# Altium schematic sheet High_Side_FETs.SchDoc
size A4; Organization: TESLA Motors, INC; Address1: 3500 Deer Creek Road; Address2: Palo Alto, CA; Address4: U.S.A.; SheetNumber: 5; SheetTotal: 8
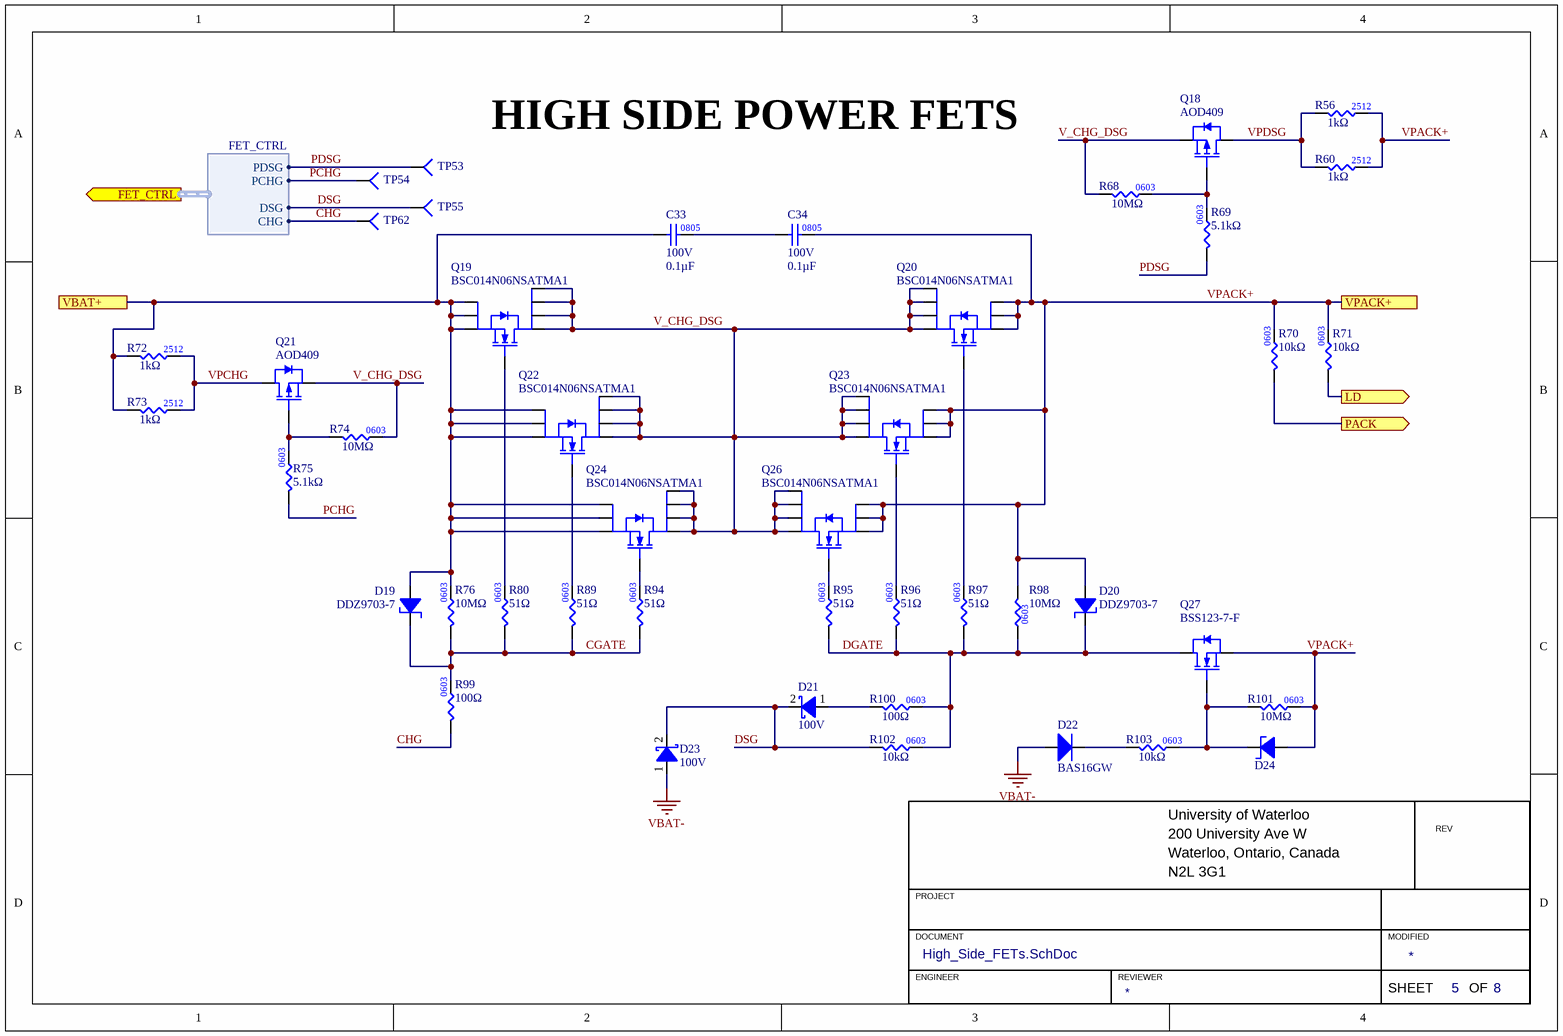
[diagram p0: High_Side_FETs.SchDoc]

## Parts
C33  value 0.1µF  Voltage Rating: 100V  [CAP0805]  (hidden comment: CAP_0.1uF_100V_0805)
C34  value 0.1µF  Voltage Rating: 100V  [CAP0805]  (hidden comment: CAP_0.1uF_100V_0805)
D19  Manufacturer Part Number 1: DDZ9703-7  [SOD-123_FLAT]  (hidden comment: DIO_ZENER_16V)
D20  Manufacturer Part Number 1: DDZ9703-7  [SOD-123_FLAT]  (hidden comment: DIO_ZENER_16V)
D21  Vr (Max): 100V  [SOD-123_FLAT]  (hidden comment: DIO_SCHOTTKY_100V_1A)
D22  Manufacturer Part Number 1: BAS16GW  [DIODSOD-123]  (hidden comment: DIO_100V_215mA)
D23  Vr (Max): 100V  [SOD-123_FLAT]  (hidden comment: DIO_SCHOTTKY_100V_1A)
D24  DIO_ZENER_16V  [SOD-123_FLAT]  (value not drawn)
Q18  Manufacturer Part Number 1: AOD409  [TO-252 AOSMD]  (hidden comment: PMOS_60V_26A)
Q19  Manufacturer Part Number 1: BSC014N06NSATMA1  [INFINEON_8-POWERTDFN]  (hidden comment: NMOS_60V_30A)
Q20  Manufacturer Part Number 1: BSC014N06NSATMA1  [INFINEON_8-POWERTDFN]  (hidden comment: NMOS_60V_30A)
Q21  Manufacturer Part Number 1: AOD409  [TO-252 AOSMD]  (hidden comment: PMOS_60V_26A)
Q22  Manufacturer Part Number 1: BSC014N06NSATMA1  [INFINEON_8-POWERTDFN]  (hidden comment: NMOS_60V_30A)
Q23  Manufacturer Part Number 1: BSC014N06NSATMA1  [INFINEON_8-POWERTDFN]  (hidden comment: NMOS_60V_30A)
Q24  Manufacturer Part Number 1: BSC014N06NSATMA1  [INFINEON_8-POWERTDFN]  (hidden comment: NMOS_60V_30A)
Q26  Manufacturer Part Number 1: BSC014N06NSATMA1  [INFINEON_8-POWERTDFN]  (hidden comment: NMOS_60V_30A)
Q27  Manufacturer Part Number 1: BSS123-7-F  [SOT23-3]  (hidden comment: NMOS_100V_170mA)
R56  value 1kΩ  [RES2512]  (hidden comment: RES_1kΩ_2512_1%)
R60  value 1kΩ  [RES2512]  (hidden comment: RES_1kΩ_2512_1%)
R68  value 10MΩ  [RES0603]  (hidden comment: RES_10MΩ_0603_1%)
R69  value 5.1kΩ  [RES0603]  (hidden comment: RES_5.1kΩ_0603_1%)
R70  value 10kΩ  [RES0603]  (hidden comment: RES_10kΩ_0603_1%)
R71  value 10kΩ  [RES0603]  (hidden comment: RES_10kΩ_0603_1%)
R72  value 1kΩ  [RES2512]  (hidden comment: RES_1kΩ_2512_1%)
R73  value 1kΩ  [RES2512]  (hidden comment: RES_1kΩ_2512_1%)
R74  value 10MΩ  [RES0603]  (hidden comment: RES_10MΩ_0603_1%)
R75  value 5.1kΩ  [RES0603]  (hidden comment: RES_5.1kΩ_0603_1%)
R76  value 10MΩ  [RES0603]  (hidden comment: RES_10MΩ_0603_1%)
R80  value 51Ω  [RES0603]  (hidden comment: RES_51Ω_0603_1%)
R89  value 51Ω  [RES0603]  (hidden comment: RES_51Ω_0603_1%)
R94  value 51Ω  [RES0603]  (hidden comment: RES_51Ω_0603_1%)
R95  value 51Ω  [RES0603]  (hidden comment: RES_51Ω_0603_1%)
R96  value 51Ω  [RES0603]  (hidden comment: RES_51Ω_0603_1%)
R97  value 51Ω  [RES0603]  (hidden comment: RES_51Ω_0603_1%)
R98  value 10MΩ  [RES0603]  (hidden comment: RES_10MΩ_0603_1%)
R99  value 100Ω  [RES0603]  (hidden comment: RES_100Ω_0603_1%)
R100  value 100Ω  [RES0603]  (hidden comment: RES_100Ω_0603_1%)
R101  value 10MΩ  [RES0603]  (hidden comment: RES_10MΩ_0603_1%)
R102  value 10kΩ  [RES0603]  (hidden comment: RES_10kΩ_0603_1%)
R103  value 10kΩ  [RES0603]  (hidden comment: RES_10kΩ_0603_1%)
TP53  TESTPOINT_1MM_CIRCLE  [TESTPOINT_CIRCLE_1MM]  (value not drawn)  (no BOM)
TP54  TESTPOINT_1MM_CIRCLE  [TESTPOINT_CIRCLE_1MM]  (value not drawn)  (no BOM)
TP55  TESTPOINT_1MM_CIRCLE  [TESTPOINT_CIRCLE_1MM]  (value not drawn)  (no BOM)
TP62  TESTPOINT_1MM_CIRCLE  [TESTPOINT_CIRCLE_1MM]  (value not drawn)  (no BOM)

## Ports
FET_CTRL (out, harness FET_CTRL), LD (out), PACK (out), VBAT+, VPACK+

## Harnesses
FET_CTRL: PDSG, PCHG, DSG, CHG

## Nets
VBAT-: D22.1(A) D23.1(Anode)
CGATE: D19.2(Cathode) R76.1 R80.1 R89.1 R94.1 R99.2
CHG: R99.1 TP62.1(=value) ; port FET_CTRL.CHG
DGATE: D20.2(Cathode) Q27.3(DRAIN) R95.1 R96.1 R97.1 R98.1 R100.2 R102.2
DSG: D21.2(Cathode) D23.2(Cathode) R102.1 TP55.1(=value) ; port FET_CTRL.DSG
LD: R71.1 ; port LD
PACK: R70.1 ; port PACK
PCHG: R75.1 TP54.1(=value) ; port FET_CTRL.PCHG
PDSG: R69.1 TP53.1(=value) ; port FET_CTRL.PDSG
V_CHG_DSG: Q18.3(Source) Q19.5(Drain) Q19.6(Drain) Q19.7(Drain) Q19.8(Drain) Q20.5(Drain) Q20.6(Drain) Q20.7(Drain) Q20.8(Drain) Q21.3(Source) Q22.5(Drain) Q22.6(Drain) Q22.7(Drain) Q22.8(Drain) Q23.5(Drain) Q23.6(Drain) Q23.7(Drain) Q23.8(Drain) Q24.5(Drain) Q24.6(Drain) Q24.7(Drain) Q24.8(Drain) Q26.5(Drain) Q26.6(Drain) Q26.7(Drain) Q26.8(Drain) R68.1 R74.2
VBAT+: C33.1 D19.1(Anode) Q19.1(Source) Q19.2(Source) Q19.3(Source) Q22.1(Source) Q22.2(Source) Q22.3(Source) Q24.1(Source) Q24.2(Source) Q24.3(Source) R72.1 R73.1 R76.2 ; port VBAT+
VPACK+: C34.2 D20.1(Anode) D24.1(Anode) Q20.1(Source) Q20.2(Source) Q20.3(Source) Q23.1(Source) Q23.2(Source) Q23.3(Source) Q26.1(Source) Q26.2(Source) Q26.3(Source) Q27.2(SOURCE) R56.2 R60.2 R70.2 R71.2 R98.2 R101.2 ; port VPACK+
VPCHG: Q21.2(Drain) R72.2 R73.2
VPDSG: Q18.2(Drain) R56.1 R60.1
NetC33_2: C33.2 C34.1
NetD21_1: D21.1(Anode) R100.1
NetD22_2: D22.2(K) R103.1
NetD24_2: D24.2(Cathode) Q27.1(GATE) R101.1 R103.2
NetQ18_1: Q18.1(Gate) R68.2 R69.2
NetQ19_4: Q19.4(Gate) R80.2
NetQ20_4: Q20.4(Gate) R97.2
NetQ21_1: Q21.1(Gate) R74.1 R75.2
NetQ22_4: Q22.4(Gate) R89.2
NetQ23_4: Q23.4(Gate) R96.2
NetQ24_4: Q24.4(Gate) R94.2
NetQ26_4: Q26.4(Gate) R95.2

## Notes on the sheet
- HIGH SIDE POWER FETS
- University of Waterloo
- 200 University Ave W
- REV
- PROJECT
- Waterloo, Ontario, Canada
- N2L 3G1
- DOCUMENT
- ENGINEER
- REVIEWER
- MODIFIED
- SHEET
- OF
- (in symbol RES_10MΩ_0603_1%) 0603
- (in symbol RES_51Ω_0603_1%) 0603
- (in symbol RES_100Ω_0603_1%) 0603

## Library data of the parts
C33 C34 = CAP_0.1uF_100V_0805: CAP CER 0.1UF 100V X7R 0805; Manufacturer 1: TDK Corporation; Manufacturer Part Number 1: C2012X7R2A104K125AA; Package: 0805; Supplier 1: Digi-Key; Supplier Part Number 1: 445-1418-1-ND
D19 D20 = DIO_ZENER_16V: DIODE ZENER 16V 500MW SOD123; Manufacturer 1: Diodes Incorporated; Forward Voltage: 900mV; Supplier 1: Digi-Key; Supplier Part Number 1: DDZ9703-7DICT-ND
D21 D23 = DIO_SCHOTTKY_100V_1A: DIODE SCHOTTKY 100V 1A SOD-123F; Manufacturer 1: SMC Diode Solutions; Manufacturer Part Number 1: DSS110U; Supplier 1: Digi-Key; Supplier Part Number 1: 1655-DSS110UCT-ND; Mounting Type: SMD; Package/Footprint: SOD-123F
D22 = DIO_100V_215mA: DIODE GEN PURP 100V 215MA SOD123; Manufacturer 1: Nexperia; Package/Footprint: SOD-123; Package: SOD-123; Supplier Part Number 1: 1727-7320-1-ND; Supplier 1: Digi-Key; Mounting Type: SMD; Verified: No
D24 = DIO_ZENER_16V: DIODE ZENER 16V 500MW SOD123; Manufacturer Part Number 1: DDZ9703-7; Manufacturer 1: Diodes Incorporated; Forward Voltage: 900mV; Supplier 1: Digi-Key; Supplier Part Number 1: DDZ9703-7DICT-ND
Q18 Q21 = PMOS_60V_26A: MOSFET P-CH 60V 26A TO252; Manufacturer 1: Alpha & Omega Semiconductor Inc.; Vgs (Max): ±20V; Vdss: 60V; Mounting Type: SMD; Id: 26A; Supplier 1: Digi-Key; Supplier Part Number 1: 785-1103-1-ND
Q19 Q20 Q22-Q24 Q26 = NMOS_60V_30A: MOSFET N-CH 60V 30A/100A TDSON7; Manufacturer 1: Infineon Technologies; FET Type: N-Channel; Vgs (Max): 20V; Power Dissipation (Max): 2.5W; Id: 30A; Supplier 1: Digi-Key; Supplier Part Number 1: BSC014N06NSATMA1CT-ND; Vdss: 60V; Supplier Device Package: 8-PowerTDFN
Q27 = NMOS_100V_170mA: MOSFET N-CH 100V 170MA SOT23-3; Manufacturer 1: Diodes Incorporated; Supplier 1: Digi-Key; Supplier Part Number 1: BSS123-FDICT-ND
R56 R60 R72 R73 = RES_1kΩ_2512_1%: RES SMD 1K OHM 1% 3W 2512; Manufacturer 1: TE Connectivity Passive Product; Manufacturer Part Number 1: 35221K0FT; Supplier Part Number 1: A121161CT-ND; Supplier 1: Digi-Key; Mounting Type: SMD; Package: 2512
R68 R74 R76 R98 R101 = RES_10MΩ_0603_1%: RES 10M OHM 1% 1/10W 0603; Manufacturer 1: YAGEO; Manufacturer Part Number 1: RC0603FR-0710ML; Supplier 1: Digi-Key; Supplier Part Number 1: 311-10.0MHRCT-ND
R69 R75 = RES_5.1kΩ_0603_1%: RES 5.1K OHM 1% 1/10W 0603; Manufacturer 1: YAGEO; Manufacturer Part Number 1: RC0603FR-135K1L; Mounting Type: SMD; Package: 0603; Supplier 1: Digi-Key; Supplier Part Number 1: 13-RC0603FR-135K1LCT-ND
R70 R71 R102 R103 = RES_10kΩ_0603_1%: RES 10K OHM 1% 1/8W 0603; Manufacturer 1: Stackpole Electronics Inc; Manufacturer Part Number 1: RNCP0603FTD10K0; Supplier Part Number 1: RNCP0603FTD10K0CT-ND; Supplier 1: Digi-Key; Mounting Type: SMD; Package: 0603
R80 R89 R94-R97 = RES_51Ω_0603_1%: RES 51 OHM 1% 1/10W 0603; Manufacturer 1: YAGEO; Manufacturer Part Number 1: RC0603FR-0751RL; Supplier 1: Digi-Key; Supplier Part Number 1: 311-51.0HRCT-ND
R99 R100 = RES_100Ω_0603_1%: RES 100 OHM 1% 1/10W 0603; Manufacturer 1: Yageo; Manufacturer Part Number 1: RC0603FR-07100RL; Supplier Part Number 1: 311-100HRCT-ND; Supplier 1: Digi-Key
TP53-TP55 TP62 = TESTPOINT_1MM_CIRCLE: TESTPOINT 1MM CIRCLE